# EAGLE design schematic (EAGLE 6.4)
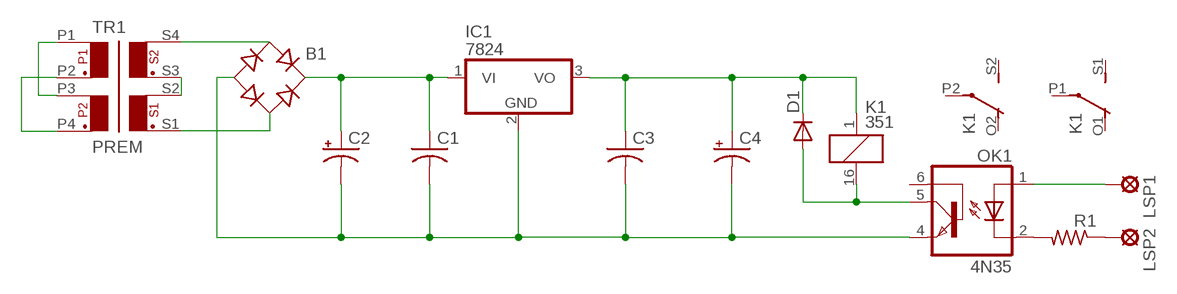
[diagram p0: schematic, sheet 1]

## Parts
B1  B-DIL  [B-DIL]
C1  C-US025-024X044  [C025-024X044]
C2  CPOL-USE5-8.5  [E5-8,5]
C3  C-US025-024X044  [C025-024X044]
C4  CPOL-USE2.5-7  [E2,5-7]
D1  1N4148DO35-7  [DO35-7]
IC1  7824  7824T  [TO220H]
K1  351  [351]
LSP1  LSP10  [LSP10]
LSP2  LSP10  [LSP10]
OK1  4N35  [DIL06]
R1  R-US_0204/2V  [0204V]
TR1  PREM  [PREM-2P2S]

## Nets
N$1: TR1.S2 TR1.S3
N$2: B1.AC1 TR1.S4
N$3: B1.AC2 TR1.S1
N$4: B1.+ C1.1 C2.+ IC1.1(VI)
N$5: B1.- C1.2 C2.- C3.2 C4.- IC1.2(GND) OK1.4(EMI)
N$6: C3.1 C4.+ D1.C IC1.3(VO) K1.1
N$9: D1.A K1.16 OK1.5(COL)
N$10: OK1.2(C) R1.2
N$11: LSP1.MP OK1.1(A)
N$12: LSP2.MP R1.1
N$17: TR1.P1 TR1.P3
N$18: TR1.P2 TR1.P4
Unconnected: K1.O1(2:O) K1.O2(3:O) K1.P1(2:P) K1.P2(3:P) K1.S1(2:S) K1.S2(3:S) OK1.6(BAS)

## Library data of the parts
B1 = rectifier:B-DIL: RECTIFIER
C1 C3 = resistor:C-US: CAPACITOR, American symbol
C2 C4 = resistor:CPOL-US: POLARIZED CAPACITOR, American symbol
D1 = diode:1N4148: DIODE high speed (Philips)
IC1 = linear:78*: Positive VOLTAGE REGULATOR Source: http://cache.national.com/ds/LM/LM78L05.pdf http://www.fairchildsemi.com/ds/LM/LM7805.pdf
K1 = relay:351: RELAY 2 x switch, Omron; OC_FARNELL: unknown; OC_NEWARK: unknown
LSP1 LSP2 = solpad:LSP10: SOLDER PAD drill 1.0 mm, distributor Buerklin, 12H555
OK1 = optocoupler:4N35: MOTOROLA OPTO COUPLER; MF: FAIRCHILD SEMICONDUCTOR; MPN: 4N35; OC_FARNELL: 1328375; OC_NEWARK: 72K9946
R1 = resistor:R-US_: RESISTOR, American symbol
TR1 = glitchworks:PREM

## Board
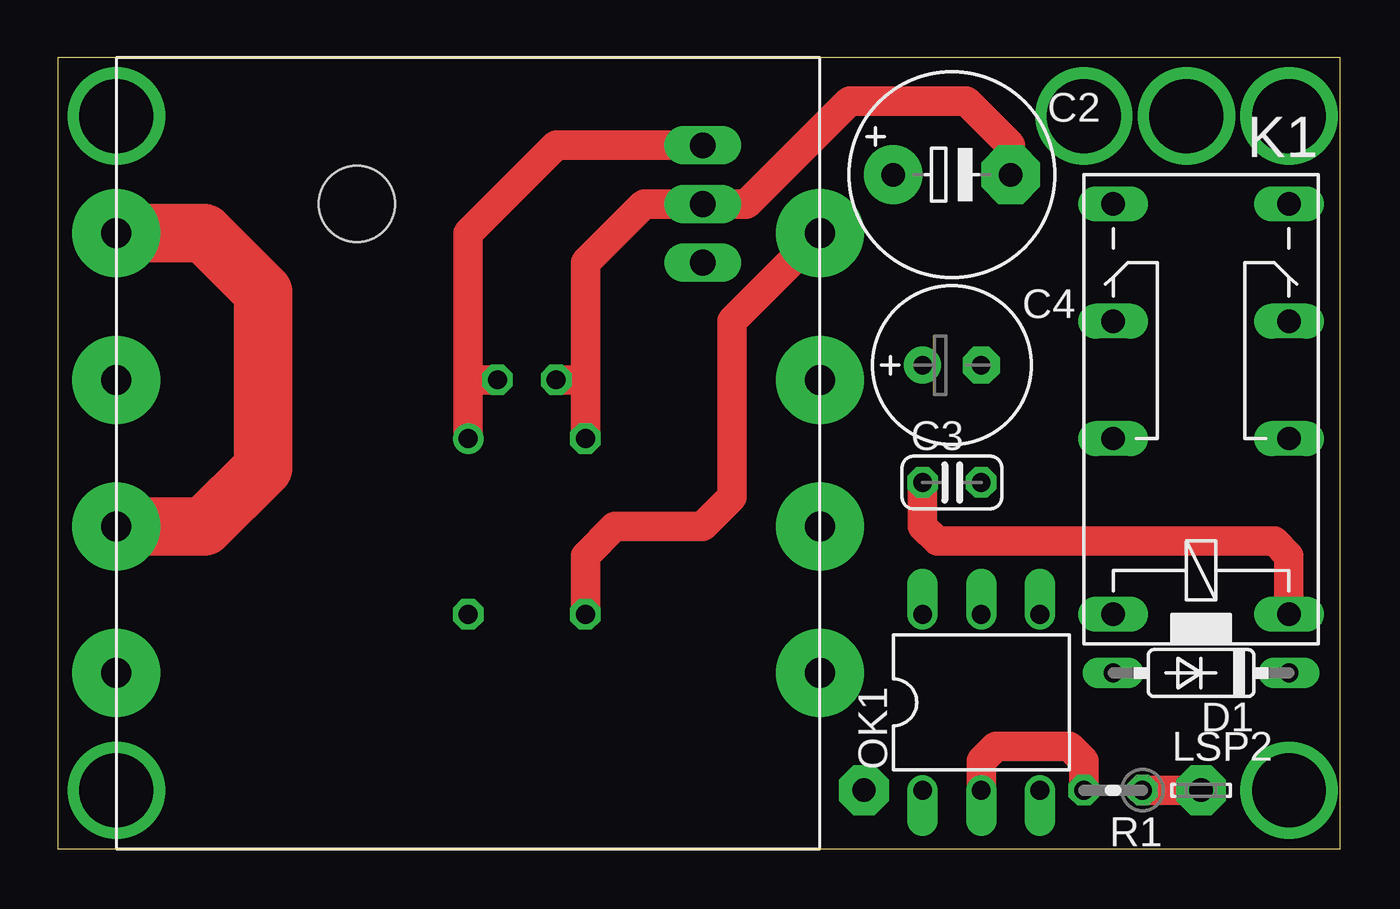
[diagram p1: board, top side]
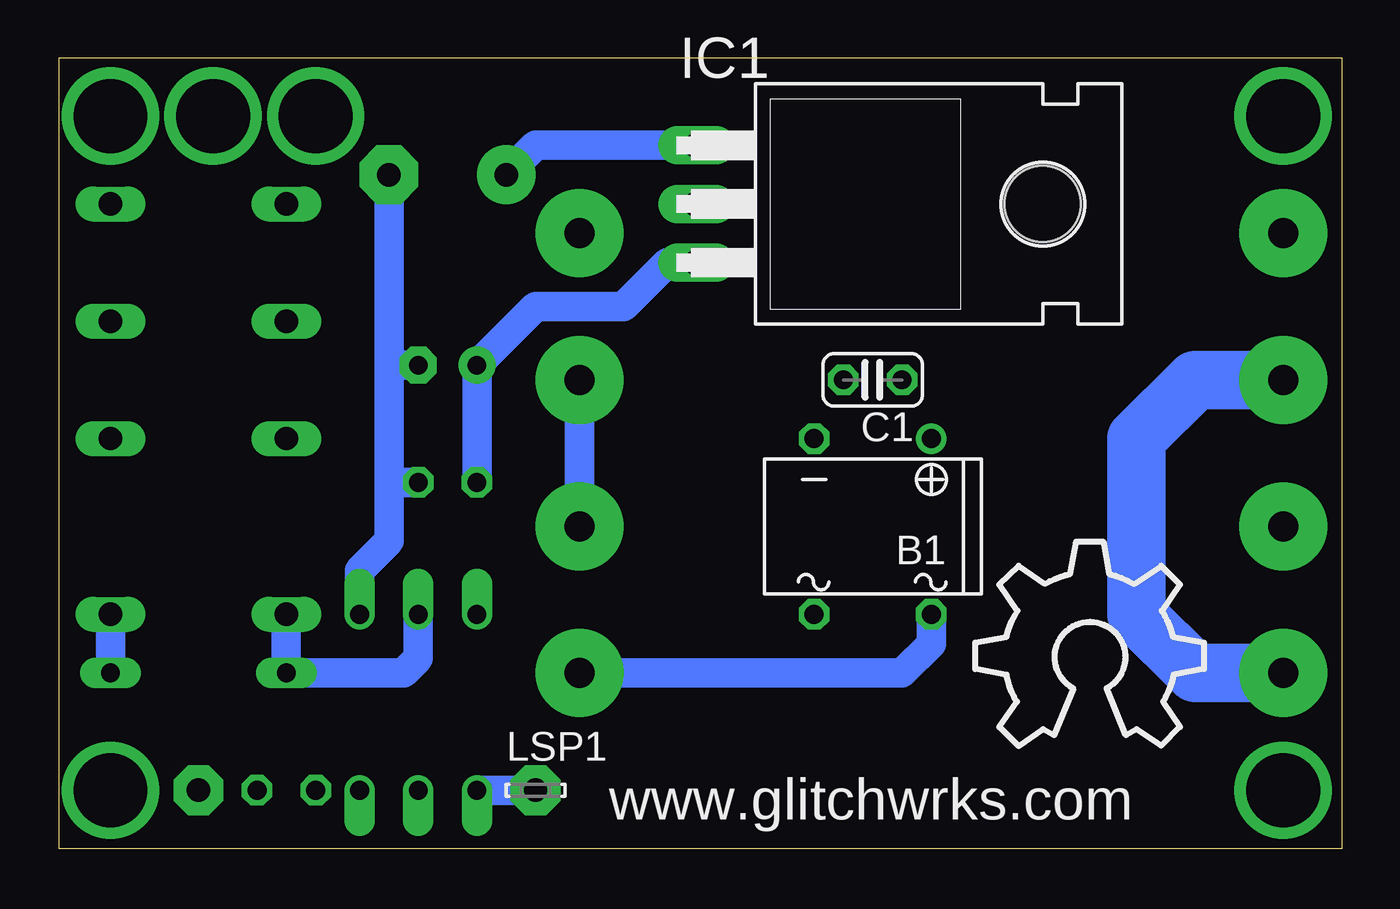
[diagram p2: board, bottom side, seen from below]

Size 55.55 x 34.28 mm. Coordinates in mm from the lower left corner, seen from the top.
Outline: 0,0 55.55,0 55.55,34.28 0,34.28 0,0
Copper layers (1*16): Top 0.035mm / dielectric 1.5mm / Bottom 0.035mm
Design rules "default": minimum track width 10mil, minimum drill 24mil, track to track 8mil, track to pad 8mil, pad to pad 8mil, via to via 8mil, smd to smd 8mil, copper to edge 40mil, drill to drill 8mil, minimum pad ring 10mil, minimum via ring 8mil, stop-mask expansion 4mil, vias tented up to drill 0mil, thermal gap 10mil

### Footprints (pad centres in the part's own frame; a part is rotated, then mirrored left to right if it is on the bottom)
B-DIL = drill 0.813: + -2.54,-3.81 | drill 0.813 octagon: - 2.54,-3.81; AC1 2.54,3.81; AC2 -2.54,3.81
C025-024X044 = drill 0.813 octagon: 1 -1.27,0; 2 1.27,0
E5-8,5 = drill 1.016 pad 2.54: + -2.54,0 | drill 1.016 pad 2.54 octagon: - 2.54,0
E2,5-7 = drill 0.813 pad 1.6: + -1.27,0 | drill 0.813 pad 1.6 octagon: - 1.27,0
DO35-7 = drill 0.813 long: A 3.81,0; C -3.81,0
TO220H = drill 1.118 long: 1 -2.54,-10.16; 2 0,-10.16; 3 2.54,-10.16 | hole 3.302: 0,4.826
351 = drill 1.016 long: 1 -3.81,-3.81; 16 -3.81,3.81; O1 8.89,-3.81; O2 8.89,3.81; P1 3.81,-3.81; P2 3.81,3.81; S1 13.97,-3.81; S2 13.97,3.81
LSP10 = drill 1.016 pad 2.159 octagon: MP 0,0
DIL06 = drill 0.813 offset: 1 -2.54,-3.81; 2 0,-3.81; 3 2.54,-3.81; 4 2.54,3.81; 5 0,3.81; 6 -2.54,3.81
0204V = drill 0.813 octagon: 1 -1.27,0; 2 1.27,0
PREM-2P2S = drill 1.3 pad 3.81: P1 7.62,0; P2 13.97,0; P3 20.32,0; P4 26.67,0; S1 26.67,30.48; S2 20.32,30.48; S3 13.97,30.48; S4 7.62,30.48

### Placement (x,y rotation side)
B1  20.32,13.97 180 bottom
C1  20.32,20.32 180 bottom
C2  38.73,29.21 0 top
C3  38.73,15.88 0 top
C4  38.73,20.95 0 top
D1  49.53,7.62 180 top
IC1  17.78,27.94 270 bottom
K1  49.53,13.97 90 top
LSP1  34.92,2.54 0 bottom
LSP2  49.53,2.54 0 top
OK1  40.01,6.35 0 top
R1  45.72,2.54 180 top
TR1  2.54,34.29 270 top
U$1  [OSHW_10X350_NOTEXT]  15.88,4.45 0 bottom

### Tracks (layer width: path | path; a pad name or v marks a point on that pad's centre or on a via)
N$1
  Bottom 1.27: TR1.S2 TR1.S3
N$2
  Top 1.27: B1.AC1 22.86,12.7 24.13,13.97 27.94,13.97 29.21,15.24 29.21,22.86 TR1.S4
N$3
  Bottom 1.27: TR1.S1 19.05,7.62 17.78,8.89 B1.AC2
N$4
  Top 1.27: IC1.1 21.59,30.48 17.78,26.67 17.78,20.32 | 17.78,20.32 B1.+ | C1.1 17.78,20.32
  Bottom 1.27: IC1.1 34.92,30.48 C2.+
N$5
  Top 1.27: B1.- 22.86,20.32 | 22.86,20.32 22.86,25.4 25.4,27.94 IC1.2 29.84,27.94 34.29,32.38 39.37,32.38 41.27,30.48 C2.- | C1.2 22.86,20.32
  Bottom 1.27: 41.27,15.88 41.27,20.95 | 41.27,20.95 C2.- | C4.- 41.27,20.95 | C3.2 41.27,15.88 | OK1.4 42.55,12.06 41.27,13.34 41.27,15.88
N$6
  Top 1.27: C3.1 37.47,13.97 38.1,13.34 52.7,13.34 53.34,12.7 K1.1
  Bottom 1.27: IC1.3 29.21,25.4 31.11,23.5 34.92,23.5 C4.+ C3.1 | D1.C K1.1
N$7  (via drill 3.2)
  other vias: 2.54,2.54
N$8  (via drill 3.2)
  other vias: 2.54,31.75
N$9
  Bottom 1.27: OK1.5 40.01,8.26 40.64,7.62 D1.A K1.16
N$10
  Top 1.27: OK1.2 40.01,3.81 40.64,4.45 43.81,4.45 44.45,3.81 R1.2
N$11
  Bottom 1.27: OK1.1 LSP1.MP
N$12
  Top 1.27: R1.1 LSP2.MP
N$13  (via drill 3.2)
  other vias: 53.34,31.75
N$14  (via drill 3.2)
  other vias: 53.34,2.54
N$15  (via drill 3.2)
  other vias: 48.9,31.75
N$16  (via drill 3.2)
  other vias: 44.45,31.75
N$17
  Top 2.54: TR1.P1 6.35,26.67 8.89,24.13 8.89,16.51 6.35,13.97 TR1.P3
N$18
  Bottom 2.54: TR1.P2 6.35,20.32 8.89,17.78 8.89,10.16 6.35,7.62 TR1.P4

### Text on the board
bNames: www.glitchwrks.com